# EAGLE design enterCode (EAGLE 9.2.2)
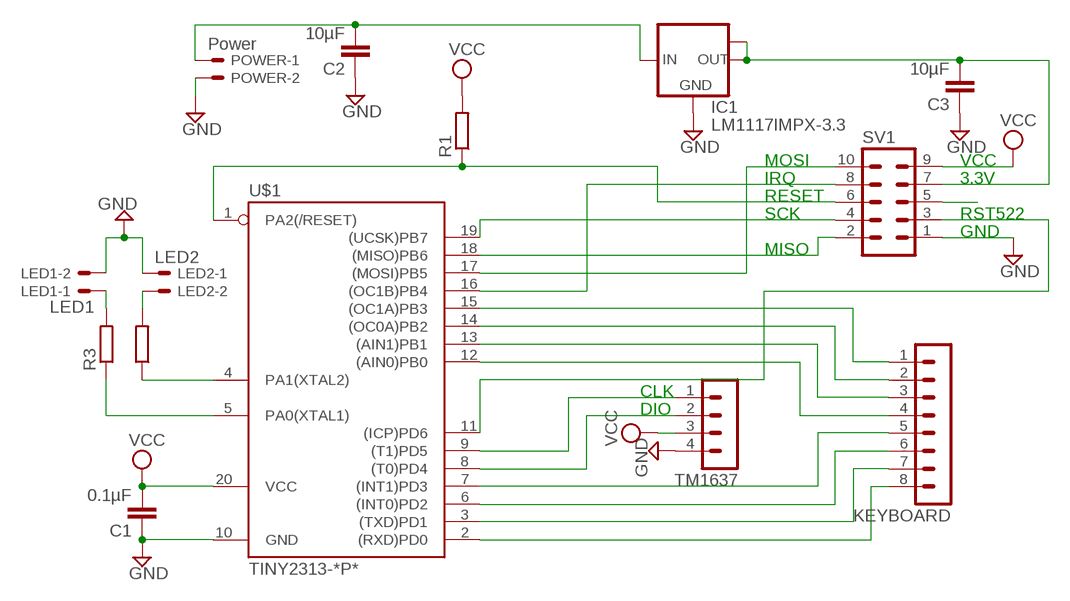
[diagram p0: schematic, sheet 1]

## Parts
C1  0.1µF  C2.5/4  [C2.5-4]
C2  10µF  C2.5/4  [C2.5-4]
C3  10µF  C2.5/4  [C2.5-4]
IC1  LM1117IMPX-3.3  [SOT223]
KEYBOARD  MA08-1  [MA08-1]
LED1  LED1  22-23-2021  [22-23-2021]
LED2  LED2  22-23-2021  [22-23-2021]
POWER  Power  22-23-2021  [22-23-2021]
R1  10k  R-EU_0207/10  [0207/10]
R2  470  R-EU_0207/10  [0207/10]
R3  470  R-EU_0207/10  [0207/10]
SV1  MA05-2  [MA05-2]
TM1637  MA04-1  [MA04-1]
U$1  TINY2313-*P*  [DIL20]

## Nets
3.3V: C3.2 IC1.2(OUT) IC1.TAB(OUT1) SV1.7
+5V: C2.2 IC1.3(IN) POWER.1
GND: C1.1 C2.1 C3.1 IC1.1(GND) LED1.2 LED2.1 POWER.2 SV1.1 TM1637.4 U$1.10(GND)
MISO: SV1.2 U$1.18((MISO)PB6)
MOSI: SV1.10 U$1.17((MOSI)PB5)
N$2: SV1.5
N$19: LED1.1 R3.2
N$20: LED2.2 R2.2
PA0: R3.1 U$1.5(PA0(XTAL1))
PA1: R2.1 U$1.4(PA1(XTAL2))
PB0: KEYBOARD.4 U$1.12((AIN0)PB0)
PB1: KEYBOARD.3 U$1.13((AIN1)PB1)
PB2: KEYBOARD.2 U$1.14((OC0A)PB2)
PB3: KEYBOARD.1 U$1.15((OC1A)PB3)
PB4: SV1.8 U$1.16((OC1B)PB4)
PD0: KEYBOARD.8 U$1.2((RXD)PD0)
PD1: KEYBOARD.7 U$1.3((TXD)PD1)
PD2: KEYBOARD.6 U$1.6((INT0)PD2)
PD3: KEYBOARD.5 U$1.7((INT1)PD3)
PD4: TM1637.2 U$1.8((T0)PD4)
PD5: TM1637.1 U$1.9((T1)PD5)
PD6: SV1.3 U$1.11((ICP)PD6)
RESET: R1.1 SV1.6 U$1.1(PA2(/RESET))
SCK: SV1.4 U$1.19((UCSK)PB7)
VCC: C1.2 R1.2 SV1.9 TM1637.3 U$1.20(VCC)

## Notes on the sheet
- MOSI | VCC
- IRQ | 3.3V
- RESET
- SCK | RST522
- GND
- MISO
- CLK
- DIO

## Library data of the parts
C1-C3 = capacitor-wima:C: CAPACITOR naming: grid - package width
IC1 = lm1117:LM1117IMPX-*
KEYBOARD = con-lstb:MA08-1: PIN HEADER; OC_FARNELL: unknown; OC_NEWARK: unknown
LED1 LED2 POWER = con-molex:22-23-2021: .100" (2.54mm) Center Header - 2 Pin; MF: MOLEX; MPN: 22-23-2021; OC_FARNELL: 1462926; OC_NEWARK: 25C3832
R1-R3 = resistor:R-EU_: RESISTOR, European symbol
SV1 = con-lstb:MA05-2: PIN HEADER; OC_FARNELL: unknown; OC_NEWARK: unknown
TM1637 = con-lstb:MA04-1: PIN HEADER; OC_FARNELL: unknown; OC_NEWARK: unknown
U$1 = avr-7:TINY2313*: Atmel Tiny2313 2K Flash, 128 bytes EEPROM, 128 bytes RAM

## Board
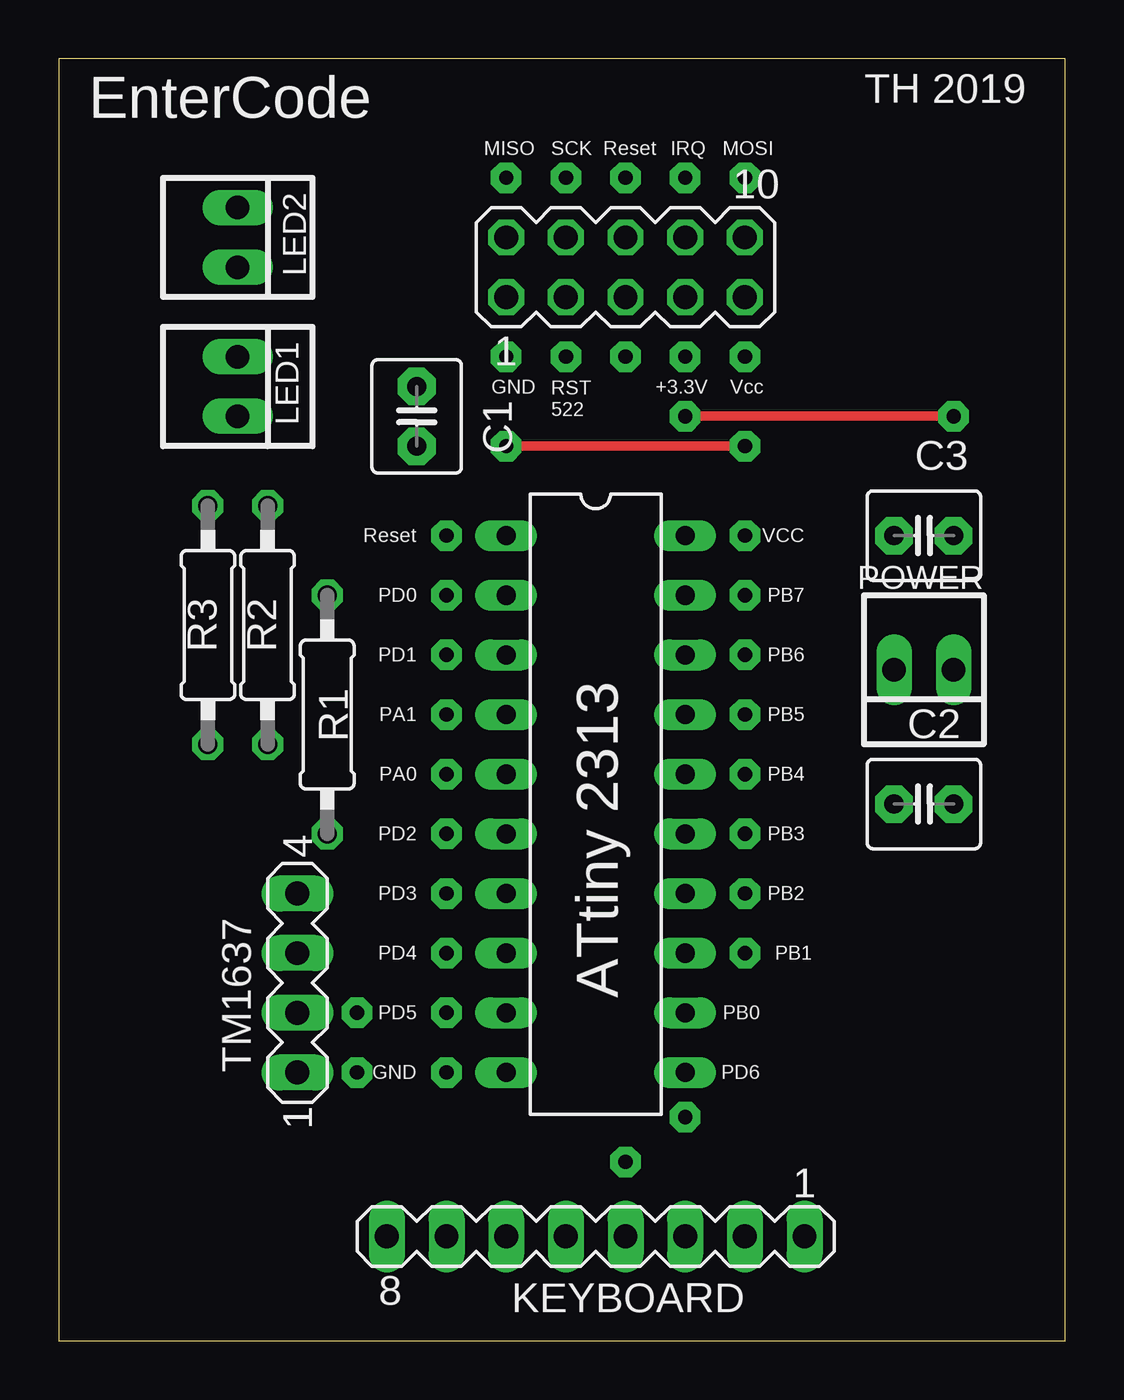
[diagram p1: board, top side]
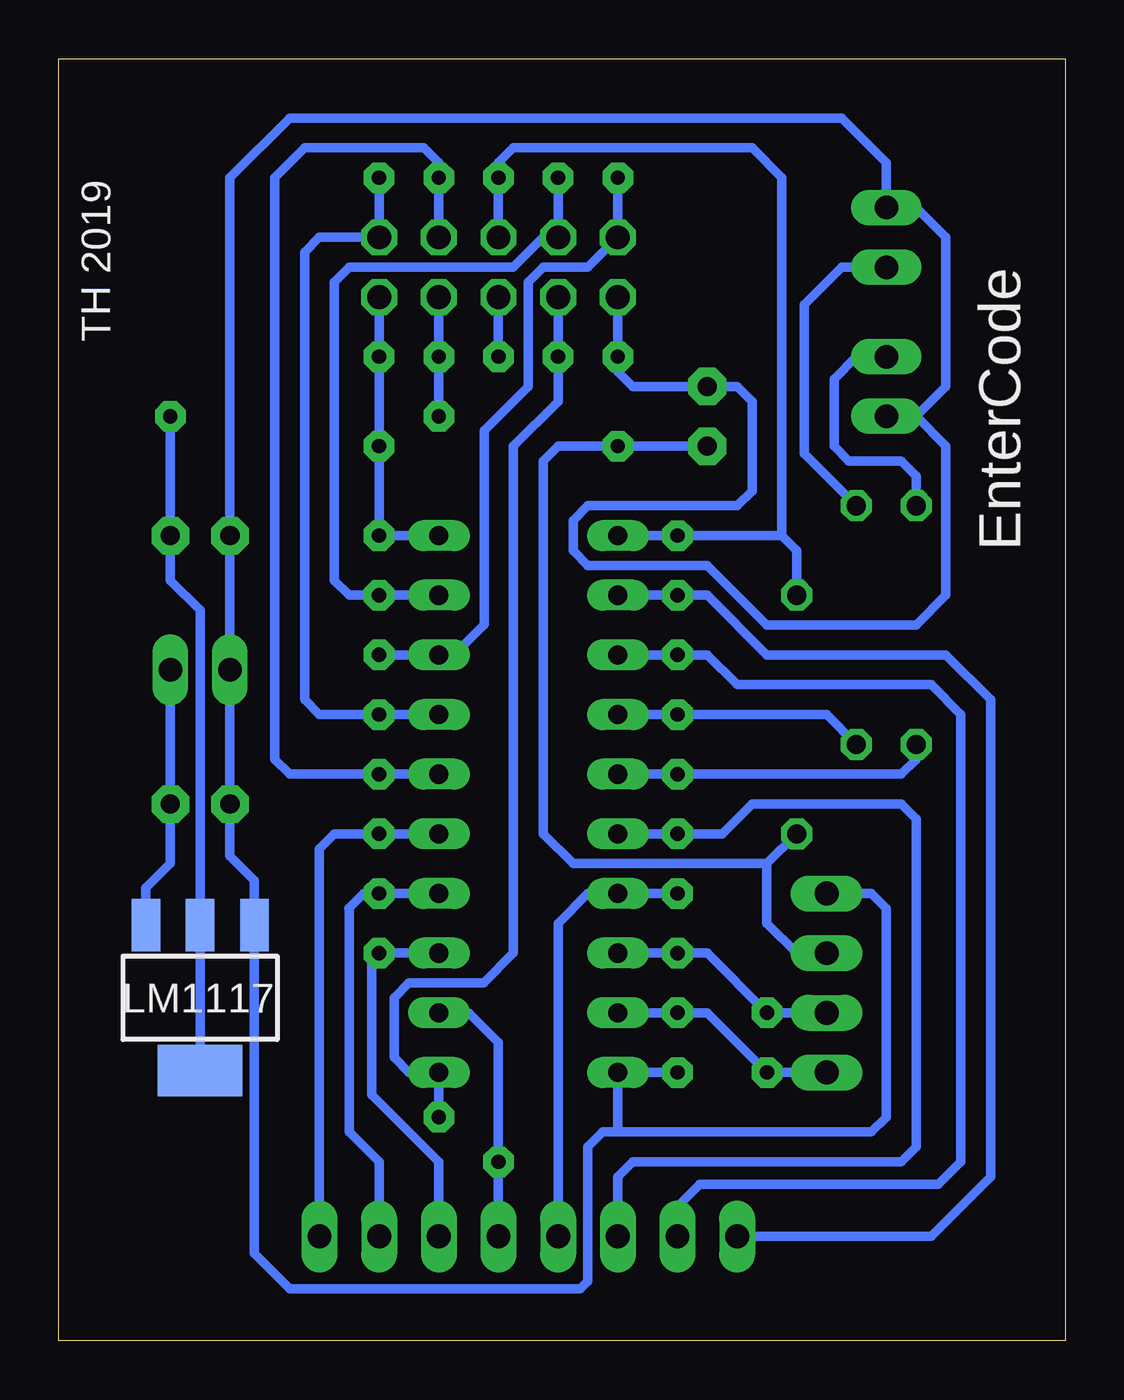
[diagram p2: board, bottom side, seen from below]

Size 42.85 x 54.6 mm. Coordinates in mm from the lower left corner, seen from the top.
Outline: 0,0 42.85,0 42.85,54.6 0,54.6 0,0
Copper layers (1*16): Top 0.035mm / dielectric 1.5mm / Bottom 0.035mm
Design rules "default *": minimum track width 16mil, minimum drill 24mil, track to track 8mil, track to pad 8mil, pad to pad 8mil, via to via 8mil, smd to smd 8mil, copper to edge 40mil, drill to drill 8mil, minimum pad ring 10mil, minimum via ring 8mil, stop-mask expansion 4mil, vias tented up to drill 0mil, thermal gap 10mil

### Footprints (pad centres in the part's own frame; a part is rotated, then mirrored left to right if it is on the bottom)
C2.5-4 = drill 0.813 pad 1.6 octagon: 1 -1.27,0; 2 1.27,0
SOT223 = smd 1.219 x 2.235: 1 -2.311,-3.099; 2 0,-3.099; 3 2.311,-3.099 | smd 3.6 x 2.2: TAB 0,3.099
MA08-1 = drill 1.016 long: 1 -8.89,0; 2 -6.35,0; 3 -3.81,0; 4 -1.27,0; 5 1.27,0; 6 3.81,0; 7 6.35,0; 8 8.89,0
22-23-2021 = drill 1 long: 1 -1.27,0; 2 1.27,0
0207/10 = drill 0.813 octagon: 1 -5.08,0; 2 5.08,0
MA05-2 = drill 1.016 octagon: 1 -5.08,-1.27; 2 -5.08,1.27; 3 -2.54,-1.27; 4 -2.54,1.27; 5 0,-1.27; 6 0,1.27; 7 2.54,-1.27; 8 2.54,1.27; 9 5.08,-1.27; 10 5.08,1.27
MA04-1 = drill 1.016 long: 1 -3.81,0; 2 -1.27,0; 3 1.27,0; 4 3.81,0
DIL20 = drill 0.813 long: 1 -11.43,-3.81; 2 -8.89,-3.81; 3 -6.35,-3.81; 4 -3.81,-3.81; 5 -1.27,-3.81; 6 1.27,-3.81; 7 3.81,-3.81; 8 6.35,-3.81; 9 8.89,-3.81; 10 11.43,-3.81; 11 11.43,3.81; 12 8.89,3.81; 13 6.35,3.81; 14 3.81,3.81; 15 1.27,3.81; 16 -1.27,3.81; 17 -3.81,3.81; 18 -6.35,3.81; 19 -8.89,3.81; 20 -11.43,3.81

### Placement (x,y rotation side)
C1  15.24,39.37 270 top
C2  36.83,22.86 0 top
C3  36.83,34.29 0 top
IC1  36.83,14.61 180 bottom
KEYBOARD  22.86,4.45 180 top
LED1  7.62,40.64 270 top
LED2  7.62,46.99 270 top
POWER  36.83,28.57 180 top
R1  11.43,26.67 270 top
R2  8.89,30.48 90 top
R3  6.35,30.48 90 top
SV1  24.13,45.72 0 top
TM1637  10.16,15.24 90 top
U$1  22.86,22.86 270 top

### Tracks (layer width: path | path; a pad name or v marks a point on that pad's centre or on a via)
3.3V  (via drill 0.61 pad 1.3)
  Top 0.406: v26.67,39.37 v38.1,39.37
  Bottom 0.406: v26.67,39.37 v26.67,41.91 SV1.7 | v38.1,39.37 C3.2 38.1,32.39 36.83,31.11 IC1.2 IC1.TAB
+5V
  Bottom 0.406: POWER.1 C2.2 38.1,20.32 39.14,19.28 IC1.3
GND  (via drill 0.61 pad 1.3)
  Bottom 0.406: 6.35,39.37 5.08,40.64 5.08,46.99 6.35,48.26 LED2.1 7.62,50.17 9.52,52.07 33.02,52.07 35.56,49.53 C3.1 POWER.2 C2.1 35.56,20.65 34.52,19.61 IC1.1 34.52,3.72 33.02,2.22 20.64,2.22 20.32,2.54 20.32,8.25 19.68,8.89 19.05,8.89 | TM1637.4 8.25,19.05 7.62,18.41 7.62,9.53 8.25,8.89 19.05,8.89 | v16.51,11.43 U$1.10 19.05,8.89 | LED1.2 6.35,39.37 | 6.35,39.37 5.08,38.1 5.08,31.75 6.35,30.48 12.7,30.48 15.24,33.02 20.32,33.02 20.96,33.66 20.96,34.92 20.32,35.56 13.97,35.56 13.33,36.2 13.33,40 13.97,40.64 C1.1 18.42,40.64 19.05,41.28 v19.05,41.91 SV1.1
MISO  (via drill 0.61 pad 1.3)
  Bottom 0.406: v29.21,29.21 U$1.18 26.04,29.21 24.74,30.5 24.74,38.76 22.86,40.64 22.86,45.08 22.22,45.72 20.32,45.72 SV1.2 v19.05,49.53
MOSI  (via drill 0.61 pad 1.3)
  Bottom 0.406: U$1.17 v29.21,26.67 31.75,26.67 32.39,27.31 32.39,46.36 31.75,46.99 SV1.10 v29.21,49.53
N$2  (via drill 0.61 pad 1.3)
  Bottom 0.406: SV1.5 v24.13,41.91
N$19
  Bottom 0.406: LED1.1 8.89,41.91 9.84,40.96 9.84,38.1 9.21,37.47 6.98,37.47 6.35,36.83 R3.2
N$20
  Bottom 0.406: R2.2 11.11,37.78 11.11,44.13 9.52,45.72 LED2.2
PA0  (via drill 0.61 pad 1.3)
  Bottom 0.406: R3.1 6.35,24.77 6.98,24.13 v16.51,24.13 U$1.5
PA1  (via drill 0.61 pad 1.3)
  Bottom 0.406: R2.1 10.16,26.67 v16.51,26.67 U$1.4
PB0  (via drill 0.61 pad 1.3)
  Bottom 0.406: KEYBOARD.4 v24.13,7.62 24.13,12.7 25.4,13.97 U$1.12
PB1  (via drill 0.61 pad 1.3)
  Bottom 0.406: KEYBOARD.3 26.67,7.62 29.53,10.48 29.53,16.51 v29.21,16.51 U$1.13
PB2  (via drill 0.61 pad 1.3)
  Bottom 0.406: U$1.14 v29.21,19.05 29.87,19.05 30.5,18.41 30.48,18.39 30.48,8.89 29.21,7.62 KEYBOARD.2
PB3  (via drill 0.61 pad 1.3)
  Bottom 0.406: KEYBOARD.1 31.75,20.96 31.11,21.59 v29.21,21.59 U$1.15
PB4  (via drill 0.61 pad 1.3)
  Bottom 0.406: U$1.16 v29.21,24.13 33.02,24.13 33.66,24.77 33.66,49.53 32.39,50.8 27.31,50.8 26.67,50.17 v26.67,49.53 SV1.8
PD0  (via drill 0.61 pad 1.3)
  Bottom 0.406: KEYBOARD.8 5.71,4.45 3.18,6.98 3.18,27.31 5.08,29.21 12.7,29.21 15.24,31.75 v16.51,31.75 U$1.2
PD1  (via drill 0.61 pad 1.3)
  Bottom 0.406: U$1.3 v16.51,29.21 15.24,29.21 13.97,27.94 5.71,27.94 4.45,26.67 4.45,7.62 5.4,6.67 15.56,6.67 16.51,5.71 KEYBOARD.7
PD2  (via drill 0.61 pad 1.3)
  Bottom 0.406: U$1.6 v16.51,21.59 14.61,21.59 13.33,22.86 6.98,22.86 6.35,22.22 6.35,8.25 6.98,7.62 18.42,7.62 19.05,6.98 KEYBOARD.6
PD3  (via drill 0.61 pad 1.3)
  Bottom 0.406: KEYBOARD.5 21.59,17.78 20.32,19.05 U$1.7 v16.51,19.05
PD4  (via drill 0.61 pad 1.3)
  Bottom 0.406: U$1.8 v16.51,16.51 15.24,16.51 v12.7,13.97 TM1637.2
PD5  (via drill 0.61 pad 1.3)
  Bottom 0.406: TM1637.1 v12.7,11.43 15.24,13.97 v16.51,13.97 U$1.9
PD6  (via drill 0.61 pad 1.3)
  Bottom 0.406: v26.67,9.53 U$1.11 27.94,11.43 28.57,12.07 28.57,14.61 27.94,15.24 24.76,15.24 23.5,16.51 23.5,38.1 21.59,40 v21.59,41.91 SV1.3
RESET  (via drill 0.61 pad 1.3)
  Bottom 0.406: U$1.1 v16.51,34.29 12.07,34.29 | R1.1 11.43,33.66 12.07,34.29 | SV1.6 v24.13,49.53 24.13,50.17 23.5,50.8 13.33,50.8 12.07,49.53 12.07,34.29
SCK  (via drill 0.61 pad 1.3)
  Bottom 0.406: U$1.19 v29.21,31.75 30.48,31.75 31.11,32.39 31.11,45.08 30.48,45.72 23.5,45.72 22.22,46.99 SV1.4 v21.59,49.53
VCC  (via drill 0.61 pad 1.3)
  Top 0.406: v29.21,38.1 v19.05,38.1
  Bottom 0.406: R1.2 12.7,20.32 | 12.7,20.32 12.7,17.78 11.43,16.51 TM1637.3 | U$1.20 v29.21,34.29 v29.21,38.1 v29.21,41.91 SV1.9 | C1.2 v19.05,38.1 21.59,38.1 22.22,37.47 22.22,21.59 20.96,20.32 12.7,20.32

### Text on the board
tNames: EnterCode | TH 2019 | MISO | SCK | Reset | IRQ | MOSI | GND | +3.3V | Vcc | RST / 522 | Reset | VCC | PD0 | PB7 | PD1 | PB6 | PA1 | PB5 | PA0 | PB4 | PD2 | PB3 | PD3 | PB2 | PD4 | PB1 | PD5 | ATtiny 2313 | PB0 | GND | PD6
bNames: TH 2019 | EnterCode | LM1117